# EAGLE schematic AVRPowerSupply (EAGLE 6.5.0)
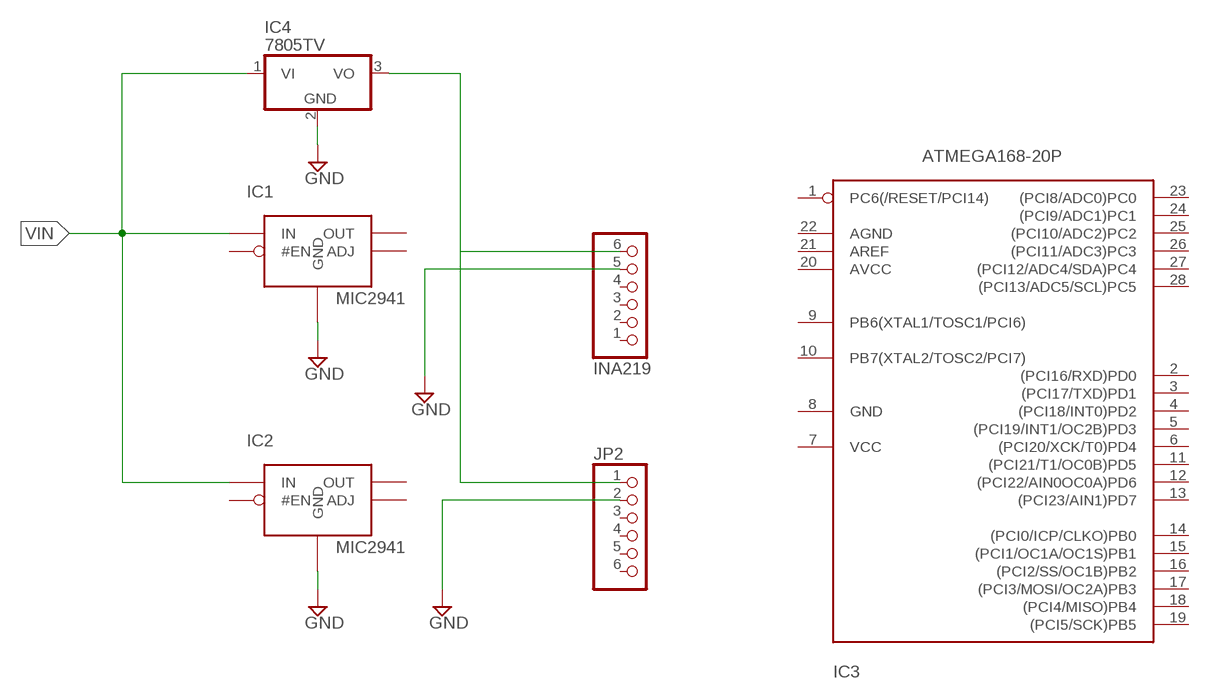
[diagram p0: schematic, sheet 1]

## Parts
IC1  BBSUP_MIC2941  [BBSUP_TO220-5]
IC2  BBSUP_MIC2941  [BBSUP_TO220-5]
IC3  ATMEGA168-20P  [DIL28-3]
IC4  7805TV  [TO220V]
INA219  PINHD-1X6  [1X06]
JP2  PINHD-1X6  [1X06]

## Nets
GND: IC1.3(GND) IC2.3(GND) IC4.2(GND) INA219.5 JP2.2
INA219: IC4.3(VO) INA219.6 JP2.1
VIN: IC1.4(IN) IC2.4(IN) IC4.1(VI)
Unconnected: IC1.1(ADJ) IC1.2(#EN) IC1.5(OUT) IC2.1(ADJ) IC2.2(#EN) IC2.5(OUT) IC3.1(PC6(/RESET/PCI14)) IC3.2((PCI16/RXD)PD0) IC3.3((PCI17/TXD)PD1) IC3.4((PCI18/INT0)PD2) IC3.5((PCI19/INT1/OC2B)PD3) IC3.6((PCI20/XCK/T0)PD4) IC3.7(VCC) IC3.8(GND) IC3.9(PB6(XTAL1/TOSC1/PCI6)) IC3.10(PB7(XTAL2/TOSC2/PCI7)) IC3.11((PCI21/T1/OC0B)PD5) IC3.12((PCI22/AIN0OC0A)PD6) IC3.13((PCI23/AIN1)PD7) IC3.14((PCI0/ICP/CLKO)PB0) IC3.15((PCI1/OC1A/OC1S)PB1) IC3.16((PCI2/SS/OC1B)PB2) IC3.17((PCI3/MOSI/OC2A)PB3) IC3.18((PCI4/MISO)PB4) IC3.19((PCI5/SCK)PB5) IC3.20(AVCC) IC3.21(AREF) IC3.22(AGND) IC3.23((PCI8/ADC0)PC0) IC3.24((PCI9/ADC1)PC1) IC3.25((PCI10/ADC2)PC2) IC3.26((PCI11/ADC3)PC3) IC3.27((PCI12/ADC4/SDA)PC4) IC3.28((PCI13/ADC5/SCL)PC5) INA219.1 INA219.2 INA219.3 INA219.4 JP2.3 JP2.4 JP2.5 JP2.6

## Library data of the parts
IC1 IC2 = supply:BBSUP_MIC2941
IC3 = adafruit:ATMEGA168*P: MICROCONTROLLER 16 kBytes FLASH 1 kBytes SRAM 512 Bytes EEPROM USART 8-channel 10 bit ADC
IC4 = linear:78*: Positive VOLTAGE REGULATOR Source: http://cache.national.com/ds/LM/LM78L05.pdf http://www.fairchildsemi.com/ds/LM/LM7805.pdf
INA219 JP2 = adafruit:PINHD-1X6: PIN HEADER